# EAGLE design led-er-v2.3d (EAGLE 7.5.0)
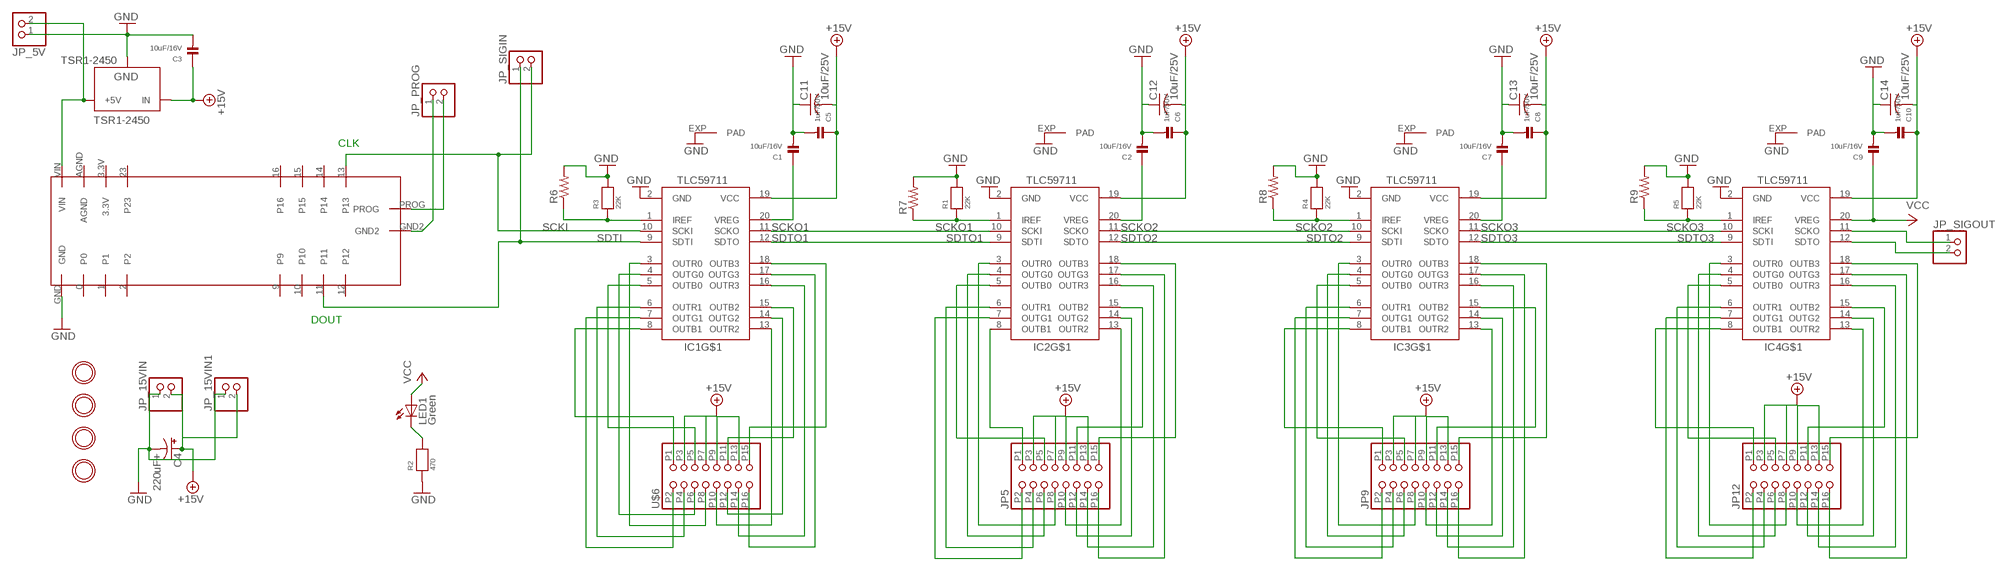
[diagram p0: schematic, sheet 1]

## Parts
C1  10uF/16V  CAP_CERAMIC0805  [0805]
C2  10uF/16V  CAP_CERAMIC0805  [0805]
C3  10uF/16V  CAP_CERAMIC0805  [0805]
C4  220uF+  CPOL-USE5-8.5  [E5-8,5]
C5  1uF/50V  CAP_CERAMIC0805  [0805]
C6  1uF/50V  CAP_CERAMIC0805  [0805]
C7  10uF/16V  CAP_CERAMIC0805  [0805]
C8  1uF/50V  CAP_CERAMIC0805  [0805]
C9  10uF/16V  CAP_CERAMIC0805  [0805]
C10  1uF/50V  CAP_CERAMIC0805  [0805]
C11  10uF/25V  C-USC0805  [C0805]
C12  10uF/25V  C-USC0805  [C0805]
C13  10uF/25V  C-USC0805  [C0805]
C14  10uF/25V  C-USC0805  [C0805]
IC1  TLC59711  [HTSSOP20DAP]
IC2  TLC59711  [HTSSOP20DAP]
IC3  TLC59711  [HTSSOP20DAP]
IC4  TLC59711  [HTSSOP20DAP]
JP5  HEADER-2X8-RIBBON  [2X08_RIBBON]
JP9  HEADER-2X8-RIBBON  [2X08_RIBBON]
JP12  HEADER-2X8-RIBBON  [2X08_RIBBON]
JP_5V  HEADER-1X2  [1X02_OVAL]
JP_15VIN  HEADER-1X2  [1X02_OVAL]
JP_15VIN1  HEADER-1X2  [1X02_OVAL]
JP_PROG  HEADER-1X2  [1X02_OVAL]
JP_SIGIN  HEADER-1X2  [1X02_OVAL]
JP_SIGOUT  HEADER-1X2  [1X02_OVAL]
LED1  Green  LEDCHIP-LED0805  [CHIP-LED0805]
R1  22K  RESISTOR0805  [0805]
R2  470  RESISTOR0805  [0805]
R3  22K  RESISTOR0805  [0805]
R4  22K  RESISTOR0805  [0805]
R5  22K  RESISTOR0805  [0805]
R6  R-US_0207/9  [0207/9]
R7  R-US_0207/10  [0207/10]
R8  R-US_0207/9  [0207/9]
R9  R-US_0207/9  [0207/9]
TSR1-2450  TSR1-2450  [TSR-1]
U$1  MOUNTINGHOLE  [MOUNTINGHOLE_3.0_PLATED]
U$2  MOUNTINGHOLE  [MOUNTINGHOLE_3.0_PLATED]
U$3  MOUNTINGHOLE  [MOUNTINGHOLE_3.0_PLATED]
U$4  MOUNTINGHOLE  [MOUNTINGHOLE_3.0_PLATED]
U$5  TEENSY_LEDER  [TEENSY_LEDER]
U$6  HEADER-2X8-RIBBON  [2X08_RIBBON]

## Nets
+15V: C3.1 C4.+ C5.1 C6.1 C8.1 C10.1 C11.2 C12.2 C13.2 C14.2 IC1.19(VCC) IC2.19(VCC) IC3.19(VCC) IC4.19(VCC) JP5.P3 JP5.P7 JP5.P9 JP5.P13 JP9.P3 JP9.P7 JP9.P9 JP9.P13 JP12.P3 JP12.P7 JP12.P9 JP12.P13 JP_15VIN1.2 JP_15VIN.2 TSR1-2450.1(IN) U$6.P3 U$6.P7 U$6.P9 U$6.P13
GND: C1.2 C2.2 C3.2 C4.- C5.2 C6.2 C7.2 C8.2 C9.2 C10.2 C11.1 C12.1 C13.1 C14.1 IC1.2(GND) IC1.EXP(PAD) IC2.2(GND) IC2.EXP(PAD) IC3.2(GND) IC3.EXP(PAD) IC4.2(GND) IC4.EXP(PAD) JP_5V.1 JP_15VIN1.1 JP_15VIN.1 R1.2 R2.1 R3.2 R4.2 R5.2 R6.2 R7.2 R8.2 R9.2 TSR1-2450.2(GND) U$5.GND
JP1: JP_5V.2 TSR1-2450.3(+5V) U$5.VIN
N$1: LED1.C R2.2
N$2: IC1.1(IREF) R3.1 R6.1
N$3: IC1.4(OUTG0) U$6.P6
N$4: IC1.3(OUTR0) U$6.P8
N$5: IC1.14(OUTG2) U$6.P12
N$6: IC1.13(OUTR2) U$6.P10
N$7: IC2.7(OUTG1) JP5.P2
N$8: IC2.6(OUTR1) JP5.P4
N$9: IC2.5(OUTB0) JP5.P5
N$10: IC2.4(OUTG0) JP5.P6
N$11: IC1.15(OUTB2) U$6.P11
N$12: IC1.16(OUTR3) U$6.P14
N$13: IC1.17(OUTG3) U$6.P16
N$14: IC1.18(OUTB3) U$6.P15
N$15: IC2.1(IREF) R1.1 R7.1
N$16: IC3.8(OUTB1) JP9.P1
N$17: IC2.13(OUTR2) JP5.P10
N$18: IC3.4(OUTG0) JP9.P6
N$19: IC4.7(OUTG1) JP12.P2
N$20: IC3.7(OUTG1) JP9.P2
N$21: IC4.6(OUTR1) JP12.P4
N$22: IC3.6(OUTR1) JP9.P4
N$23: IC2.14(OUTG2) JP5.P12
N$24: IC2.15(OUTB2) JP5.P11
N$25: IC2.16(OUTR3) JP5.P14
N$26: IC2.17(OUTG3) JP5.P16
N$27: IC2.18(OUTB3) JP5.P15
N$28: IC3.1(IREF) R4.1 R8.1
N$29: IC3.14(OUTG2) JP9.P12
N$30: IC2.8(OUTB1) JP5.P1
N$31: IC3.13(OUTR2) JP9.P10
N$37: IC3.15(OUTB2) JP9.P11
N$38: IC3.16(OUTR3) JP9.P14
N$39: IC3.17(OUTG3) JP9.P16
N$40: IC3.18(OUTB3) JP9.P15
N$41: IC4.1(IREF) R5.1 R9.1
N$42: IC2.3(OUTR0) JP5.P8
N$43: IC4.13(OUTR2) JP12.P10
N$44: IC3.5(OUTB0) JP9.P5
N$45: IC1.6(OUTR1) U$6.P4
N$46: IC1.5(OUTB0) U$6.P5
N$47: IC1.7(OUTG1) U$6.P2
N$48: IC1.8(OUTB1) U$6.P1
N$49: IC4.14(OUTG2) JP12.P12
N$50: IC4.15(OUTB2) JP12.P11
N$51: IC4.16(OUTR3) JP12.P14
N$52: IC4.17(OUTG3) JP12.P16
N$53: IC4.18(OUTB3) JP12.P15
N$54: JP_PROG.1 U$5.GND2
N$55: JP_PROG.2 U$5.PROG
N$56: C1.1 IC1.20(VREG)
N$57: C7.1 IC3.20(VREG)
N$58: C2.1 IC2.20(VREG)
N$59: IC4.11(SCKO) JP_SIGOUT.1
N$60: IC4.12(SDTO) JP_SIGOUT.2
N$61: IC3.3(OUTR0) JP9.P8
N$62: IC4.3(OUTR0) JP12.P8
N$71: IC4.4(OUTG0) JP12.P6
N$79: IC4.5(OUTB0) JP12.P5
N$80: IC4.8(OUTB1) JP12.P1
SCKI: IC1.10(SCKI) JP_SIGIN.2 U$5.13
SCKO1: IC1.11(SCKO) IC2.10(SCKI)
SCKO2: IC2.11(SCKO) IC3.10(SCKI)
SCKO3: IC3.11(SCKO) IC4.10(SCKI)
SDTI: IC1.9(SDTI) JP_SIGIN.1 U$5.11
SDTO1: IC1.12(SDTO) IC2.9(SDTI)
SDTO2: IC2.12(SDTO) IC3.9(SDTI)
SDTO3: IC3.12(SDTO) IC4.9(SDTI)
VCC: C9.1 IC4.20(VREG) LED1.A
Unconnected: U$5.0 U$5.1 U$5.2 U$5.3.3V U$5.9 U$5.10 U$5.12 U$5.14 U$5.15 U$5.16 U$5.23 U$5.AGND

## Notes on the sheet
- CLK
- DOUT

## Library data of the parts
C1-C3 C5-C10 = microbuilder:CAP_CERAMIC: Ceramic Capacitors 0402 - 0402 Surface Mount Capacitors 16pF 50V 5% [Digikey: 445-4899-2-ND] 18pF 50V 5% [Digikey: 490-1281-2-ND] 22pF 50V 5% [Digikey: 490-1283-2-ND] 68pF 50V 5% [Digikey: 490-1289-2-ND] 0.1uF 10V 10% [Digikey: 490-1318-2-ND] 1.0uF 6.3V 10% [Digikey: 490-1320-2-ND] 0603 - 0603 Surface Mount Capacitors 16 pF 50V 5% [Digikey: 445-5051-2-ND] 22 pF 50V [Digikey: PCC220ACVTR-ND] 33 pF 50V 5% [Digikey: 490-1415-1-ND] 56pF 50V 5% [Digikey: 490-1421-1-ND] 220pF 50V 5% [Digikey: 445-1285-1-ND] 680 pF 50V 2200 pF 50V 5% C0G [Digikey: 445-1297-1-ND] 5600 pF 100V 5% X7R [Digikey: 478-3711-1-ND] 0.1 µF 25V 10% [Digikey: PCC2277TR-ND] 0.22 µF 16V 10% X7R [Digikey: 445-1318-1-ND] 1.0 µF 25V 10% [Digikey: 445-5146-2-ND] 0603 - RF Specific 3pF 250V +/-0.1pF RF [Digikey: 712-1347-1-ND] 18 pF 250V 5% [Digikey: 478-3505-1-ND or 712-1322-1-ND] 56 pF 250V 5% C0G RF [Digikey: 490-4867-1-ND] 68 pF 250V RF [Digikey: 490-4868-1-ND] 0805 - 0805 Surface Mount Capacitors 220 pF 250V 2% RF Ceramic Capacitor [Digikey: 712-1398-1-ND] 1000 pF 50V 2% NP0 Ceramic Capacitor [Digikey: 478-3760-1-ND] 0.1 µF 25V 10% Ceramic Capacitor [Digikey: PCC1828TR-ND] 1.0 µF 16V 10% Ceramic Capacitor[Digikey: 490-1691-2-ND] 10.0 µF 10V 10% Ceramic Capacitor[Digikey: 709-1228-1-ND] 10.0 uF 16V 10% Ceramic Capacitor [Digikey: 478-5165-2-ND] 47 uF 6.3V 20% Ceramic Capacitor [Digikey: 587-1779-1-ND or 399-5506-1-ND] 1206 - 1206 Surface Mount Capacitors 47uF 10V 20% Ceramic Capacitor [Digikey: 490-5528-1-ND or 399-5508-1-ND or 445-6010-1-ND] 100uF 6.3V -20%, +80% Y5V Ceramic Capacitor (Digikey: 490-4512-1-ND, Mouser: 81-GRM31CF50J107ZE1L)
C4 = adafruit:CPOL-US: POLARIZED CAPACITOR, American symbol
C11-C14 = adafruit:C-US: CAPACITOR, American symbol
IC1-IC4 = adafruit:TLC59711
JP5 JP9 JP12 U$6 = Andrews:HEADER-2X8-RIBBON
JP_5V JP_15VIN JP_15VIN1 JP_PROG JP_SIGIN JP_SIGOUT = microbuilder:HEADER-1X2: PIN HEADER
LED1 = adafruit:LED: LED OSRAM: - CHIPLED LG R971, LG N971, LY N971, LG Q971, LY Q971, LO R971, LY R971 LH N974, LH R974 LS Q976, LO Q976, LY Q976 LO Q996 - Hyper CHIPLED LW Q18S LB Q993, LB Q99A, LB R99A - SideLED LS A670, LO A670, LY A670, LG A670, LP A670 LB A673, LV A673, LT A673, LW A673 LH A674 LY A675 LS A676, LA A676, LO A676, LY A676, LW A676 LS A679, LY A679, LG A679 - Hyper Micro SIDELED® LS Y876, LA Y876, LO Y876, LY Y876 LT Y87S - SmartLED LW L88C, LW L88S LB L89C, LB L89S, LG L890 LS L89K, LO L89K, LY L89K LS L896, LA L896, LO L896, LY L896 - TOPLED LS T670, LO T670, LY T670, LG T670, LP T670 LSG T670, LSP T670, LSY T670, LOP T670, LYG T670 LG T671, LOG T671, LSG T671 LB T673, LV T673, LT T673, LW T673 LH T674 LS T676, LA T676, LO T676, LY T676, LB T676, LH T676, LSB T676, LW T676 LB T67C, LV T67C, LT T67C, LS T67K, LO T67K, LY T67K, LW E67C LS E67B, LA E67B, LO E67B, LY E67B, LB E67C, LV E67C, LT E67C LW T67C LS T679, LY T679, LG T679 LS T770, LO T770, LY T770, LG T770, LP T770 LB T773, LV T773, LT T773, LW T773 LH T774 LS E675, LA E675, LY E675, LS T675 LS T776, LA T776, LO T776, LY T776, LB T776 LHGB T686 LT T68C, LB T68C - Hyper Mini TOPLED® LB M676 - Mini TOPLED Santana® LG M470 LS M47K, LO M47K, LY M47K Source: http://www.osram.convergy.de/
R1-R5 = microbuilder:RESISTOR: Resistors 0402 - 0402 Surface Mount Package 22 Ohm 1% 1/16W [Digikey: 311-22.0LRTR-ND] 33 Ohm 5% 1/16W 1.0K 5% 1/16W 1.5K 5% 1/16W 2.0K 1% 1/16W 10.0K 1% 1/16W [Digikey: 311-10.0KLRTR-ND] 10.0K 5% 1/16W [Digikey: RMCF0402JT10K0TR-ND] 12.1K 1% 1/16W [Digikey: 311-22.0LRTR-ND] 100.0K 5% 1/16W 0603 - 0603 Surface Mount Package 0 Ohm 1/10 Watt 1% Resistor 15 Ohm 1/10 Watt 1% Resistor 33 Ohm 1/10 Watt 1% Resistor 49.9 Ohm 1/10 Watt 1% Resistor 100 Ohm 1/10 Watt 1% Resistor 150 Ohm 1/10 Watt 1% Resistor 240 Ohm 1/10 Watt 1% Resistor 390 Ohm 1/10 Watt 1% Resistor 560 Ohm 1/10 Watt 1% Resistor 680 Ohm 1/10 Watt 1% Resistor 750 Ohm 1/10 Watt 1% Resistor 1.0K Ohm 1/10 Watt 1% Resistor 1.5K Ohm 1/10 Watt 1% Resistor 2.0K Ohm 1/10 Watt 1% Resistor 2.2K Ohm 1/10 Watt 1% Resistor 3.3K Ohm 1/10 Watt 1% Resistor 4.7K Ohm 1/10 Watt 1% Resistor 10.0K Ohm 1/10 Watt 1% Resistor 12.0K Ohm 1/10 Watt 1% Resistor 12.1K Ohm 1/10 Watt 1% Resistor 20.0K Ohm 1/10 Watt 1% Resistor 33.0K Ohm 1/10 Watt 1% Resistor 100.0K Ohm 1/10 Watt 1% Resistor 0805 - 0805 Surface Mount Package 0 Ohm 1/8 Watt 1% Resistor 33 Ohm 1/8 Watt 1% Resistor 100 Ohm 1/8 Watt 1% Resistor 150 Ohm 1/8 Watt 1% Resistor 200 Ohm 1/8 Watt 1% Resistor 240 Ohm 1/8 Watt 1% Resistor 330 Ohm 1/8 Watt 1% Resistor 390 Ohm 1/8 Watt 1% Resistor 470 Ohm 1/8 Watt 1% Resistor 1.0K Ohm 1/8 Watt 1% Resistor 1.5K Ohm 1/8 Watt 1% Resistor 2.0K Ohm 1/8 Watt 1% Resistor 4.7K Ohm 1/8 Watt 1% Resistor 5.1K Ohm 1/8 Watt 1% Resistor 5.6K Ohm 1/8 Watt 1% Resistor 10.0K Ohm 1/8 Watt 1% Resistor 22.0K Ohm 1/8 Watt 1% Resistor 33.0K Ohm 1/8 Watt 1% Resistor 100K Ohm 1/8 Watt 1% Resistor 1206 - 1206 Surface Mount Package 2012 - 2010 Surface Mount Package 0.11 Ohm 1/2 Watt 1% Resistor - Digikey: RHM.11UCT-ND
R6-R9 = adafruit:R-US_: RESISTOR, American symbol
TSR1-2450 = SteelCaveRobotics-Power:TSR1-2450: Traco Power TSR 1-2450 5.0v switching regulator
U$1-U$4 = microbuilder:MOUNTINGHOLE: Mounting Hole For #2 screws (0.086"/2.18mm width, 0.094"/2.4mm hole) use 2.5mm
U$5 = Andrews:TEENSY_LEDER

## Board
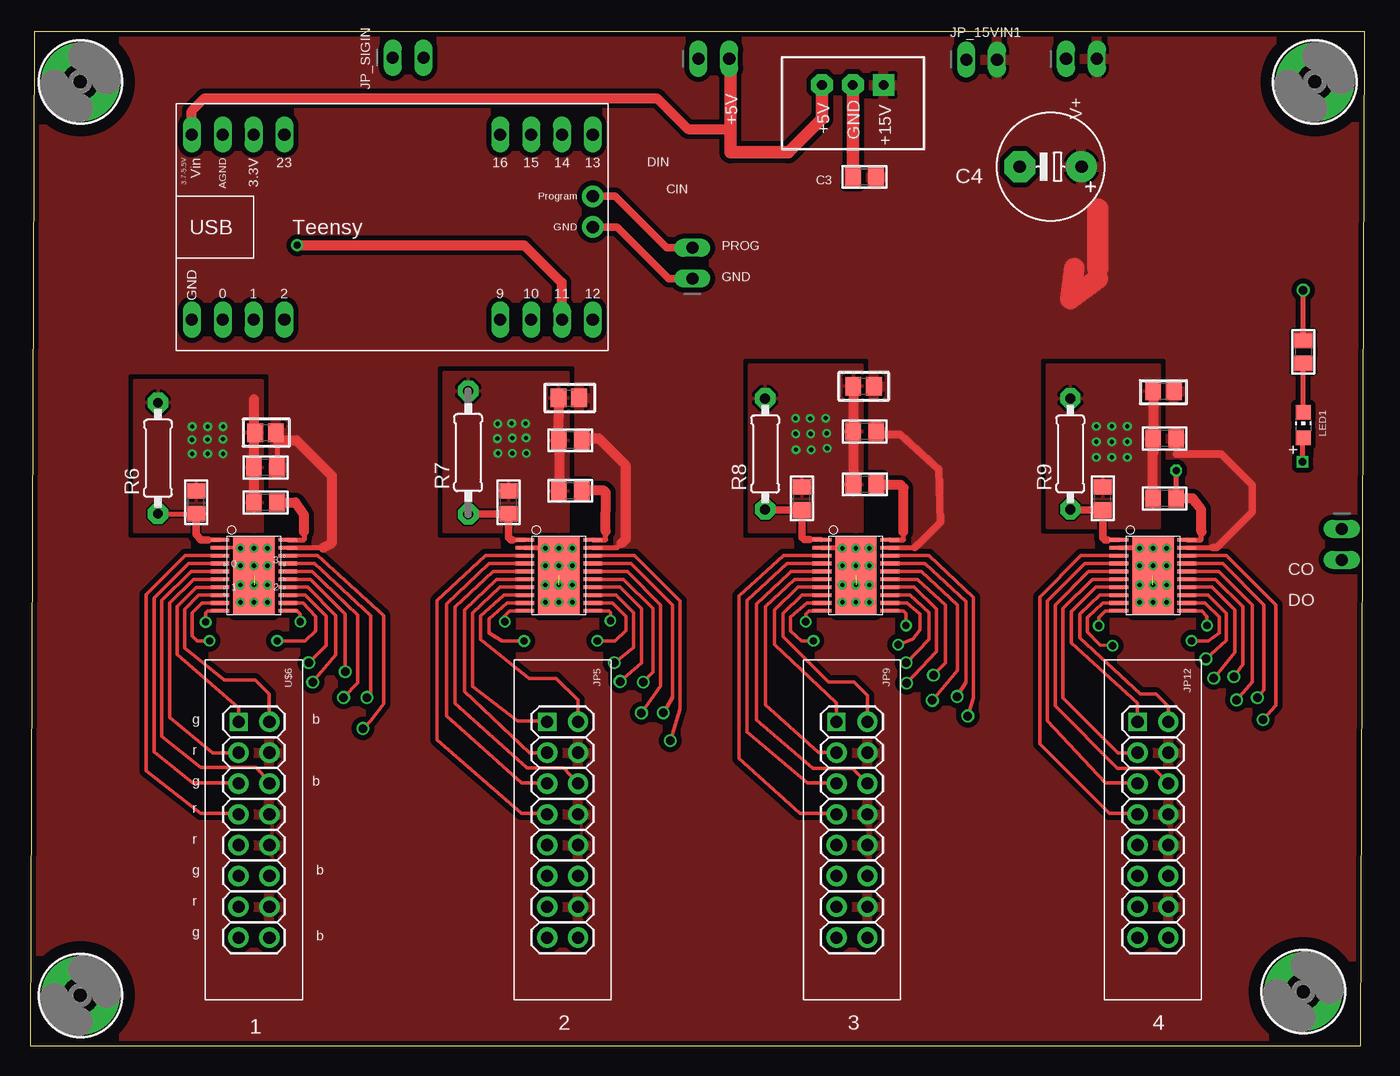
[diagram p1: board, top side]
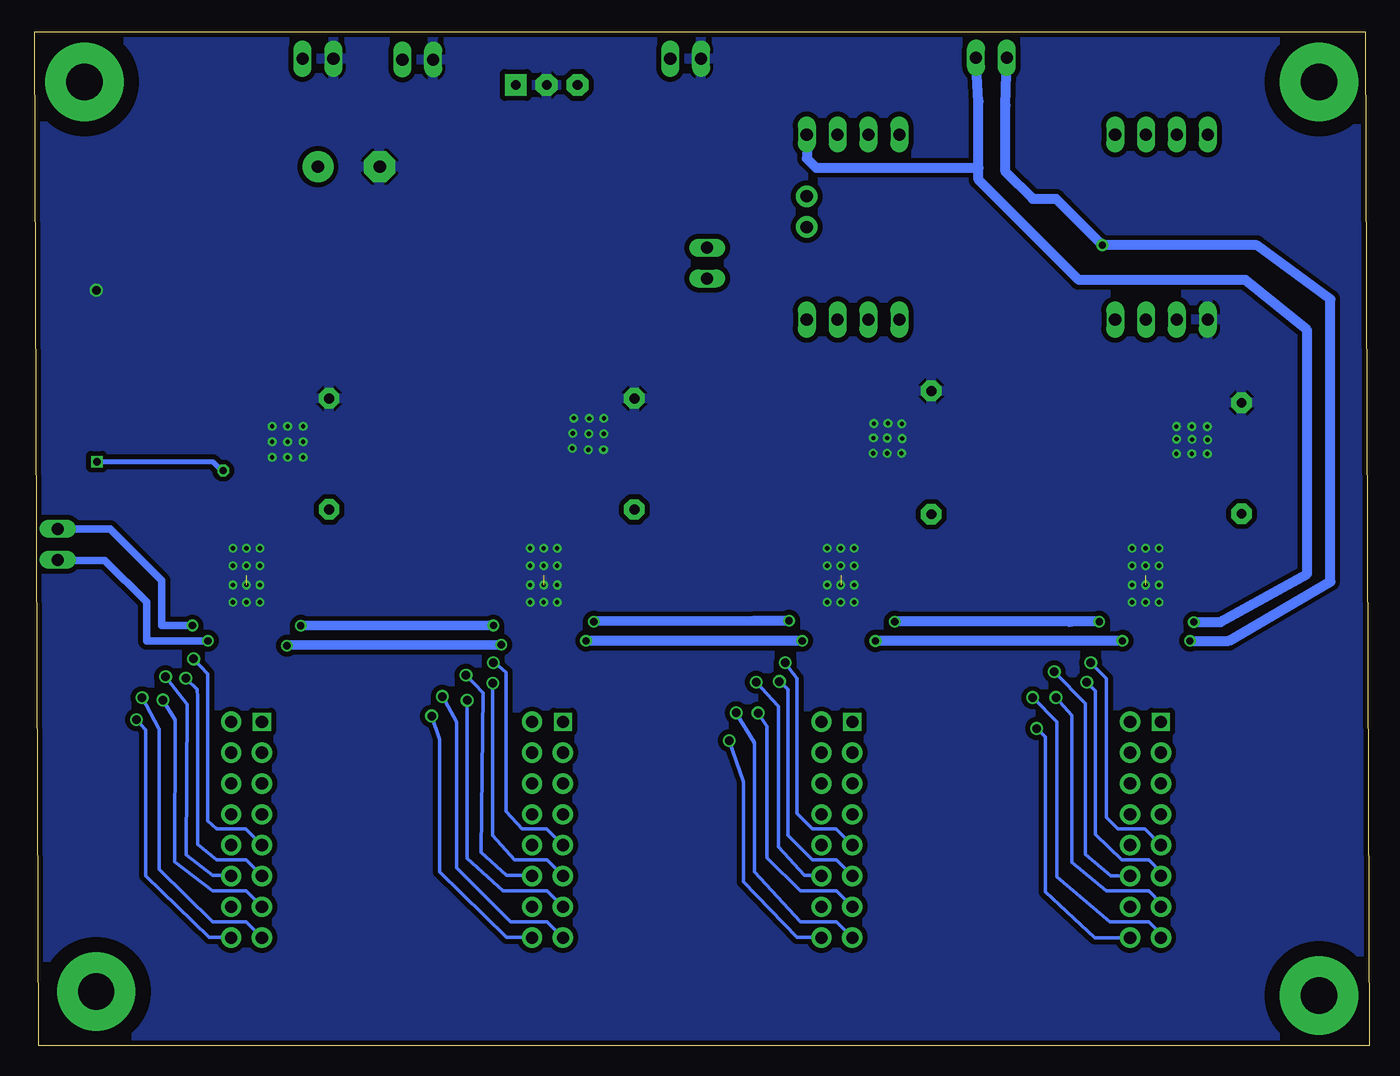
[diagram p2: board, bottom side, seen from below]

Size 109.91 x 83.49 mm. Coordinates in mm from the lower left corner, seen from the top.
Outline: 0,0 109.59,0 109.91,83.49 0.32,83.49 0,0
Copper layers (1*16): Top 0.0356mm / dielectric 1.5011mm / Bottom 0.0356mm
Design rules "LaenPCBOrder": minimum track width 6mil, minimum drill 13mil, track to track 6mil, track to pad 6mil, pad to pad 6mil, via to via 6mil, smd to smd 6mil, copper to edge 15mil, drill to drill 6mil, minimum pad ring 7mil, minimum via ring 7mil, stop-mask expansion 3mil, vias tented up to drill 0mil, thermal gap 10mil
tRestrict: area 17.5,17.5 to 19.4,18.1; area 18.5,15 to 19.4,15.3; area 42.6,17.6 to 44.9,17.9; area 66.6,17.5 to 68.5,17.8; area 67.2,15 to 68.5,15.3; area 92.1,17.5 to 93.3,17.8

### Footprints (pad centres in the part's own frame; a part is rotated, then mirrored left to right if it is on the bottom)
0805 = smd 1.3 x 1.5: 1 -0.95,0; 2 0.95,0
E5-8,5 = drill 1.016 pad 2.54: + -2.54,0 | drill 1.016 pad 2.54 octagon: - 2.54,0
C0805 = smd 1.3 x 1.5: 1 -0.85,0; 2 0.85,0
HTSSOP20DAP = smd 0.3 x 1.55: 1 -2.925,-2.8; 2 -2.275,-2.8; 3 -1.625,-2.8; 4 -0.975,-2.8; 5 -0.325,-2.8; 6 0.325,-2.8; 7 0.975,-2.8; 8 1.625,-2.8; 9 2.275,-2.8; 10 2.925,-2.8; 11 2.925,2.8; 12 2.275,2.8; 13 1.625,2.8; 14 0.975,2.8; 15 0.325,2.8; 16 -0.325,2.8; 17 -0.975,2.8; 18 -1.625,2.8; 19 -2.275,2.8; 20 -2.925,2.8 | smd 6.5 x 3.4: EXP 0,0
2X08_RIBBON = drill 1 pad 1.676: P1 -8.89,1.27; P3 -6.35,1.27; P4 -6.35,-1.27; P5 -3.81,1.27; P6 -3.81,-1.27; P7 -1.27,1.27; P8 -1.27,-1.27; P9 1.27,1.27; P10 1.27,-1.27; P11 3.81,1.27; P12 3.81,-1.27; P13 6.35,1.27; P14 6.35,-1.27; P15 8.89,1.27; P16 8.89,-1.27 | drill 1 square: P2 -8.89,-1.27
1X02_OVAL = drill 1 long: 1 -1.27,0; 2 1.27,0
CHIP-LED0805 = smd 1.2 x 1.2: A 0,-1.05; C 0,1.05
0207/9 = drill 0.813 pad 1.676 octagon: 1 -4.572,0; 2 4.572,0
0207/10 = drill 0.813 pad 1.676 octagon: 1 -5.08,0; 2 5.08,0
TSR-1 = drill 0.8 pad 1.8 square: 1 -2.54,-1.5 | drill 0.8 pad 1.8 octagon: 2 0,-1.5; 3 2.54,-1.5
MOUNTINGHOLE_3.0_PLATED = drill 3 pad 6.452: P$1 0,0
TEENSY_LEDER = drill 1 pad 1.422 long: 0 12.7,7.62; 1 10.16,7.62; 2 7.62,7.62; 3.3V 10.16,-7.62; 9 -10.16,7.62; 10 -12.7,7.62; 11 -15.24,7.62; 12 -17.78,7.62; 13 -17.78,-7.62; 14 -15.24,-7.62; 15 -12.7,-7.62; 16 -10.16,-7.62; 23 7.62,-7.62; AGND 12.7,-7.62; GND 15.24,7.62; VIN 15.24,-7.62 | drill 1 pad 1.778: GND2 -17.78,0; PROG -17.78,-2.54

### Placement (x,y rotation side)
C1  19.37,44.74 180 top
C2  44.48,45.7 180 top
C3  68.69,71.55 180 top
C4  84.04,72.4 180 top
C5  19.37,47.63 180 top
C6  44.48,49.86 180 top
C7  68.74,46.23 180 top
C8  68.72,50.58 180 top
C9  93.42,45.06 180 top
C10  93.42,50.01 180 top
C11  19.37,50.48 0 top
C12  44.35,53.35 0 top
C13  68.63,54.31 0 top
C14  93.32,53.91 0 top
IC1  18.42,38.73 270 top
IC2  43.52,38.73 270 top
IC3  67.99,38.73 270 top
IC4  92.46,38.73 270 top
JP5  43.84,17.78 270 top
JP9  67.68,17.78 270 top
JP12  92.46,17.78 270 top
JP_5V  56.29,81.28 0 top
JP_15VIN  86.58,81.28 0 top
JP_15VIN1  78.35,81.22 0 top
JP_PROG  54.53,64.45 90 top
JP_SIGIN  31.11,81.38 0 top
JP_SIGOUT  108.02,41.28 270 top
LED1  104.84,51.12 0 top
R1  39.4,44.75 90 top
R2  104.84,57.15 270 top
R3  13.66,44.75 90 top
R4  63.55,45.07 90 top
R5  88.34,45.07 90 top
R6  10.51,48.38 90 top
R7  36.06,48.85 90 top
R8  60.52,48.73 90 top
R9  85.66,48.74 90 top
TSR1-2450  67.74,77.63 180 top
U$1  105.8,79.38 0 top
U$2  4.12,4.12 0 top
U$3  104.84,4.44 0 top
U$4  4.12,79.38 0 top
U$5  28.54,67.42 180 top
U$6  18.42,17.78 270 top

### Tracks (layer width: path | path; a pad name or v marks a point on that pad's centre or on a via)
+15V
  Top 0.406: IC1.19 24.13,41.01 | 20.32,49.86 C5.1 | IC2.19 48.33,41.01 48.73,41.41 | 45.58,50.01 C6.1 | IC3.19 72.86,41.01 | 69.74,50.33 C8.1 | IC4.19 97.39,41.01 | 94.37,48.73 C10.1
  Top 0.61: 69.74,50.33 71.67,50.33 74.85,47.46 74.94,43.07 73.42,41.55 72.86,41.01 | 94.37,48.73 98.1,48.73 100.65,46.19 100.65,43.95 97.7,41.01 97.39,41.01
  Top 0.813: 20.32,49.86 21.91,49.86 24.84,46.93 24.84,41.41 24.13,41.01 | 45.58,50.01 46.82,50.01 49.05,47.78 49.05,41.73 48.73,41.41
  Top 1.676: 87.91,63.16 85.68,61.47 86,64.02
  Top 1.778: 87.91,68.89 87.91,64.02
  pour Top (isolate 0.406, rank 2): 0.32,83.19 0,0 109.29,0 109.6,83.19
GND  (via drill 0.36, 0.7)  (4 unrouted)
  Top 0.305: 42.2,41.01 v42.41,40.96 | IC1.2 17.47,41.01 v17.31,40.96
  Top 0.406: IC2.2 42.2,41.01 | R2.1 v104.84,62.23 | IC3.2 67.04,41.01 v66.88,40.96 | IC4.2 91.51,41.01 v91.35,40.96 | 43.53,40.8 v43.52,40.96
  Top 0.61: 18.42,45.37 C1.2 | 18.42,53.25 C11.1 | 43.47,49.96 C6.2
  Top 0.813: C1.2 C5.2 18.42,53.25 | C12.1 43.47,49.96 | C6.2 C2.2 | C13.1 67.78,50.27 C8.2 67.77,46.24 C7.2 | 67.79,41 v67.99,40.96 | C9.2 C10.2 92.47,48.75 C14.1
  Top 1.016: TSR1-2450.2 C3.2
  other vias: 93.57,36.51 92.46,36.51 91.35,36.51 93.57,37.94 92.46,37.94 91.35,37.94 93.57,39.53 92.46,39.53 91.35,39.53 69.1,37.94 67.99,37.94 66.88,37.94 69.1,36.51 67.99,36.51 66.88,36.51 69.1,39.53 67.99,39.53 66.88,39.53 42.41,37.94 43.52,37.94 44.64,37.94 44.64,39.53 43.52,39.53 42.41,39.53 42.41,36.51 43.52,36.51 44.64,36.51 19.53,39.53 18.42,39.53 17.31,39.53 18.42,40.96 19.53,40.96 19.53,37.94 18.42,37.94 17.31,37.94 17.31,36.51 18.42,36.51 19.53,36.51 44.64,40.96 69.1,40.96 92.46,40.96 93.57,40.96 15.87,50.99 14.59,49.93 15.87,48.76 13.3,49.91 13.33,48.76 38.49,51.21 40.83,50.05 39.63,51.26 40.78,51.24 39.7,50.05 38.47,50 65.64,49.19 64.32,49.09 65.52,51.68 64.27,50.4 63.03,50.4 15.87,49.96 14.6,48.76 13.33,50.99 14.6,50.99 39.7,48.8 38.52,48.79 40.84,48.79 63.06,49.09 65.58,50.44 64.23,51.66 63.02,51.66 87.8,49.74 89.08,48.47 87.8,48.47 90.35,49.74 90.35,51.02 89.08,51.02 89.08,49.74 90.35,48.47 87.8,51.02
  pour Bottom (isolate 0.406, rank 2): 0,83.19 0,0 109.6,0 109.6,83.19
  pour Top: 8.6,54.78 19.11,54.78 19.11,42.36 8.6,42.36
  pour Top: 34.08,42.36 34.08,55.42 44.27,55.42 44.27,42.36
  pour Top: 59.24,42.36 68.48,42.36 68.48,56.06 59.24,56.06
  pour Top: 83.77,56.06 93.01,56.06 93.01,42.68 83.77,42.68
JP1
  Top 0.813: U$5.VIN 13.3,77 14.33,78.04 51.6,78.04 54.15,75.49 57.65,75.49
  Top 1.016: JP_5V.2 57.65,80.87 57.65,75.49 57.65,73.58 62.43,73.58 65.2,76.35 TSR1-2450.3
N$1
  Top 0.406: LED1.C R2.2
N$2
  Top 0.406: R6.1 14.29,43.8 R3.1 | IC1.1 14.63,41.66 | 14.63,41.66
  Top 0.61: 14.63,41.66 14.08,41.66 13.65,42.09 R3.1
N$3
  Top 0.305: IC1.4 13.03,39.71 10.19,36.88 10.19,24.21 13.38,21.66 17.08,21.66 U$6.P6
N$4
  Top 0.305: IC1.3 12.76,40.36 9.55,37.16 9.55,22.61 14.02,19.11 17.09,19.11 U$6.P8
N$5  (via drill 0.7)
  Top 0.305: IC1.14 22.82,37.76 25.16,35.42 25.16,32.17 v23.25,29.94
  Bottom 0.305: U$6.P12 17.15,14.28 18.16,15.29 20.39,15.29 22.54,17.41 22.54,29.2 v23.25,29.94
N$6  (via drill 0.7)
  Top 0.305: IC1.13 22.65,37.11 23.25,36.51 24.37,35.39 24.37,32.96 v22.93,31.53
  Bottom 0.305: v22.93,31.53 21.66,30.26 21.66,18.79 20.7,17.84 18.48,17.84 U$6.P10
N$7
  Top 0.305: IC2.7 38.69,37.76 36.43,35.64 36.43,29.57 40.13,26.75 42.48,26.75 JP5.P2
N$8
  Top 0.305: IC2.6 38.41,38.41 35.76,35.88 35.76,29.16 41.13,24.12 JP5.P4
N$9
  Top 0.305: IC2.5 38.1,39.06 34.98,36.14 34.98,28.18 40.93,22.87 43.93,22.87 JP5.P5
N$10
  Top 0.305: IC2.4 37.8,39.71 34.27,36.4 34.27,27.16 40.45,21.66 42.5,21.66 JP5.P6
N$11  (via drill 0.7)
  Top 0.305: IC1.15 23.07,38.41 25.94,35.57 v25.94,30.79
  Bottom 0.305: U$6.P11 21.29,13.97 23.37,15.74 23.37,28.16 v25.94,30.79
N$12  (via drill 0.7)
  Top 0.305: IC1.16 23.22,39.05 26.97,35.46 26.97,29.88 v25.8,28.67
  Bottom 0.305: U$6.P14 17.15,11.73 18.16,12.74 21.66,12.74 24.48,15.11 24.48,27.21 v25.8,28.67
N$13  (via drill 0.7)
  Top 0.305: IC1.17 23.41,39.71 28.03,35.41 28.03,28.98 v27.71,28.67
  Bottom 0.305: U$6.P16 17.15,9.19 18.16,10.19 21.34,10.19 25.73,13.91 25.73,26.65 v27.71,28.67
N$14  (via drill 0.7)
  Top 0.305: IC1.18 23.65,40.35 29.08,35.44 29.08,28.13 28.03,26.75 | 28.03,26.75 | 28.03,26.75 v27.39,26.12
  Bottom 0.305: U$6.P15 22.58,8.89 26.67,12.67 26.67,25.41 v27.39,26.12
N$15
  Top 0.406: IC2.1 39.7,41.66 | 39.7,41.66
  Top 0.61: R7.1 36.14,43.8 R1.1 39.4,41.85 39.59,41.66 39.7,41.66
N$16
  Top 0.305: IC3.8 63.56,37.11 61.97,35.61 61.97,33.72 65.73,29.95 67.84,29.94 68.94,28.84 JP9.P1
N$17  (via drill 0.7)
  Top 0.305: IC2.13 48.25,37.11 49.69,35.67 49.69,32.81 v48.1,31.53
  Bottom 0.305: v48.1,31.53 47.14,30.26 47.14,19.11 45.87,17.84 43.9,17.84 JP5.P10
N$18
  Top 0.305: IC3.4 62.32,39.71 59.02,36.67 59.02,25.84 64.02,21.66 66.33,21.66 JP9.P6
N$19
  Top 0.305: IC4.7 87.77,37.76 85.75,35.77 85.75,33.18 91.18,28.22 91.18,26.68 JP12.P2
N$20
  Top 0.305: IC3.7 63.24,37.76 61.29,35.88 61.29,33.05 66.4,28.24 JP9.P2
N$21
  Top 0.305: IC4.6 87.46,38.41 85.04,35.99 85.04,28.62 89.56,24.11 91.17,24.11 JP12.P4
N$22
  Top 0.305: IC3.6 62.93,38.41 60.56,36.16 60.56,28.07 64.92,24.13 JP9.P4
N$23  (via drill 0.7)
  Top 0.305: IC2.14 48.56,37.76 50.33,35.99 50.33,31.53 v48.58,29.99
  Bottom 0.305: v48.58,29.99 47.86,29.32 47.88,17.32 45.87,15.29 43.89,15.29 JP5.P12
N$24  (via drill 0.7)
  Top 0.305: IC2.15 48.87,38.41 51.28,35.99 51.28,30.78 v50.49,29.94
  Bottom 0.305: v50.49,29.94 48.67,27.95 48.67,16.37 46.5,14.02 45.16,14.02 JP5.P11
N$25  (via drill 0.7)
  Top 0.305: IC2.16 49.17,39.06 51.92,36.31 51.92,29.62 v50.33,27.39
  Bottom 0.305: v50.33,27.39 49.6,26.29 49.6,15.46 46.82,12.74 43.88,12.74 JP5.P14
N$26  (via drill 0.7)
  Top 0.305: IC2.17 49.48,39.71 52.87,36.31 52.87,28.67 v52.13,27.41
  Bottom 0.305: JP5.P16 43.88,10.19 46.82,10.19 50.62,14.3 50.62,24.94 v52.13,27.41
N$27  (via drill 0.7)
  Top 0.305: IC2.18 49.78,40.36 53.51,36.63 53.51,27.71 v52.71,25.12
  Bottom 0.305: JP5.P15 45.14,8.92 47.14,8.92 51.53,13.51 51.53,21.71 v52.71,25.12
N$28
  Top 0.305: IC3.1 65.17,41.68
  Top 0.406: 65.17,41.68 64.16,41.68 64.16,41.67
  Top 0.61: R8.1 60.56,44.12 R4.1 63.55,41.87 63.75,41.67 64.16,41.67
N$29  (via drill 0.7)
  Top 0.305: IC3.14 72.77,37.76 74.65,35.96 74.65,32.46 v72.18,29.86
  Bottom 0.305: v72.18,29.86 72.2,17.3 70.39,15.29 67.73,15.29 JP9.P12
N$30
  Top 0.305: IC2.8 39.01,37.1 37.1,35.38 37.1,33.47 41.09,30.26 43.32,30.26 45.11,28.47 JP5.P1
N$31  (via drill 0.7)
  Top 0.305: IC3.13 72.46,37.11 74.01,35.67 74.01,33.44 v72.14,31.53
  Bottom 0.305: v72.14,31.53 71.98,31.53 71.09,30.74 71.09,19.27 69.75,17.84 67.73,17.84 JP9.P10
N$37  (via drill 0.7)
  Top 0.305: IC3.15 73.07,38.41 75.37,36.28 75.37,31.5 v74.39,30.52
  Bottom 0.305: v74.39,30.52 72.99,29.06 73.12,15.9 71.03,14.02 68.99,14.02 JP9.P11
N$38  (via drill 0.7)
  Top 0.305: IC3.16 73.38,39.06 76.34,36.31 76.34,30.9 v74.29,28.44
  Bottom 0.305: v74.29,28.44 74.3,15.43 71.35,12.74 67.72,12.74 JP9.P14
N$39  (via drill 0.7)
  Top 0.305: IC3.17 73.68,39.71 77.04,36.6 77.04,29.91 v76.33,28.76
  Bottom 0.305: v76.33,28.76 75.18,26.64 75.18,14.65 70.71,10.19 67.71,10.19 JP9.P16
N$40  (via drill 0.7)
  Top 0.305: IC3.18 73.99,40.36 77.69,36.91 77.69,28.63 v77.21,27.15
  Bottom 0.305: JP9.P15 68.98,8.92 71.03,8.92 76.58,14.32 76.58,25.23 v77.21,27.15
N$41
  Top 0.406: IC4.1 88.7,41.66
  Top 0.61: R9.1 85.7,44.12 R5.1 88.34,41.82 88.5,41.66 88.7,41.66
N$42
  Top 0.305: IC2.3 37.49,40.36 33.52,36.65 33.52,25.18 40.45,19.11 42.51,19.11 JP5.P8
N$43  (via drill 0.7)
  Top 0.305: IC4.13 96.99,37.11 98.52,35.6 98.52,33.37 v96.83,31.85
  Bottom 0.305: v96.83,31.85 95.68,30.6 95.68,18.5 94.92,17.84 92.52,17.84 JP12.P10
N$44
  Top 0.305: IC3.5 62.63,39.06 62.43,38.86 | 62.43,38.86 | 62.43,38.86 59.82,36.38 59.82,26.84 64.45,22.84 65.71,22.84 65.72,22.85 67.7,22.85 JP9.P5
N$45
  Top 0.305: IC1.6 13.44,38.41 11.47,36.44 11.47,27.03 15.01,24.12 U$6.P4 16.79,24.13
N$46
  Top 0.305: IC1.5 13.23,39.05 10.83,36.66 10.83,25.48 14.04,22.91 18.56,22.91 19.69,21.78 U$6.P5
N$47
  Top 0.305: IC1.7 13.66,37.75 12.09,36.19 12.09,32.23 17.15,27.81 U$6.P2
N$48
  Top 0.305: IC1.8 13.86,37.11 12.69,35.94 12.69,32.76 15.97,30.12 18.52,30.12 19.69,28.95 U$6.P1
N$49  (via drill 0.7)
  Top 0.305: IC4.14 97.29,37.76 99.22,35.9 99.22,32.39 v97.47,30.26
  Bottom 0.305: JP12.P12 92.51,15.29 94.92,15.29 96.49,16.59 96.49,28.69 96.53,29.33 v97.47,30.26
N$50  (via drill 0.7)
  Top 0.305: IC4.15 97.6,38.41 99.87,36.16 99.87,31.38 v99.13,30.38
  Bottom 0.305: JP12.P11 93.78,14.02 95.24,14.02 97.42,15.71 97.37,28.1 v99.13,30.38
N$51  (via drill 0.7)
  Top 0.305: IC4.16 97.9,39.06 100.65,36.31 100.65,29.94 v99.35,28.47
  Bottom 0.305: JP12.P14 92.5,12.74 95.24,12.74 98.38,15.14 98.35,26.51 98.35,26.83 v99.35,28.47
N$52  (via drill 0.7)
  Top 0.305: IC4.17 98.21,39.71 101.61,36.31 101.61,29.3 v101.07,28.66
  Bottom 0.305: JP12.P16 92.5,10.19 95.24,10.19 99.65,14.53 99.67,26.07 99.7,26.14 v101.07,28.66
N$53  (via drill 0.7)
  Top 0.305: IC4.18 98.52,40.36 102.56,36.31 102.56,28.03 v101.54,26.85
  Bottom 0.305: v101.54,26.85 100.78,25.99 100.75,14 95.56,8.92 93.76,8.92 JP12.P15
N$54
  Top 0.406: JP_PROG.1
  Top 0.61: U$5.GND2 48.33,67.42 52.57,63.19 JP_PROG.1
N$55
  Top 0.406: 54.51,65.74 JP_PROG.2
  Top 0.61: U$5.PROG 48.17,69.96 52.39,65.74 54.51,65.74
N$56
  Top 0.406: 22.55,42.34 22.55,41.66 IC1.20
  Top 0.813: C1.1 21.83,44.74 22.54,43.71 22.55,42.34
N$57
  Top 0.406: 71.48,41.66 IC3.20 71.92,41.66 71.91,42.34
  Top 0.813: 71.91,42.34 71.92,45.94 71.67,46.19 69.73,46.19 C7.1
N$58
  Top 0.406: IC2.20 47.39,41.66 47.39,42.06 47.39,42.38 | C2.1
  Top 0.813: C2.1 47.23,45.71 47.4,45.54 47.39,42.38
N$59  (via drill 0.6)
  Top 0.305: IC4.11 | IC4.11 96.47,35.81 96.91,35.37 v96.91,34.6
  Bottom 0.406: JP_SIGOUT.1
  Bottom 0.61: v96.91,34.6 99.43,34.6 99.43,38.31 103.67,42.55 JP_SIGOUT.1
N$60  (via drill 0.6)
  Top 0.305: IC4.12 96.75,36.45 97.93,35.3 97.94,34.01 97.04,33.34 v95.64,33.34
  Bottom 0.406: 107.97,39.96 JP_SIGOUT.2
  Bottom 0.61: v95.64,33.34 100.7,33.34 100.7,36.53 104.14,39.96 107.97,39.96
N$61
  Top 0.305: IC3.3 62.02,40.36 58.35,37.04 58.35,23.66 63.38,19.11 66.34,19.11 JP9.P8
N$62
  Top 0.305: IC4.3 86.54,40.36 83.13,36.95 83.13,24.84 88.87,19.11 91.13,19.11 JP12.P8
N$71
  Top 0.305: IC4.4 86.85,39.71 83.77,36.63 83.77,26.75 88.55,21.66 91.12,21.66 JP12.P6
N$79
  Top 0.305: IC4.5 87.15,39.06 84.41,36.31 84.41,27.96 89.52,22.85 90.61,22.85 | 90.61,22.85 92.54,22.85 JP12.P5 | 90.61,22.85
N$80
  Top 0.305: IC4.8 88.07,37.11 86.44,35.55 86.46,33.56 91.41,28.98 92.69,28.98 93.73,27.94 JP12.P1
SCKI  (via drill 0.6)
  Top 0.305: IC1.10 14.62,35.81 14.45,35.65 v14.45,34.9 v14.44,34.89
  Bottom 0.813: v14.44,34.89 12.25,34.89 5.1,38.86 5.1,58.92 10.19,63.07 23.89,63.07 32.17,71.35 32.17,72.3 | 32.17,72.3 32.17,77.77 JP_SIGIN.2 | U$5.13 46.32,73.08 45.55,72.3 32.17,72.3
SCKO1  (via drill 0.6)
  Top 0.305: IC1.11 21.99,35.8 22.23,35.57 v22.23,34.92 | IC2.10 40.68,35.81 39.45,35.81 39.08,35.38 39.08,35.24 v39.08,34.92
  Bottom 0.305: v22.23,34.92 24.73,34.6
  Bottom 0.813: v22.23,34.92 v39.08,34.92
SCKO2  (via drill 0.6)
  Top 0.305: v63.86,34.92 63.87,35.56 64.12,35.81 IC3.10 | IC2.11 47.64,35.81 47.78,35.67 v47.78,35 v47.78,34.99
  Bottom 0.406: 50.64,34.99 50.64,34.98
  Bottom 0.813: v47.78,34.99 50.64,34.98 v63.86,34.92
SCKO3  (via drill 0.6)
  Top 0.305: IC3.11 70.85,35.81 71.91,35.81 72.12,35.59 v72.12,34.6 | v88,34.58 87.99,35.26 87.99,35.27 88.53,35.8 IC4.10
  Bottom 0.813: v72.12,34.6 v88,34.58
SDTI  (via drill 0.6)
  Top 0.305: v14.77,33.34 13.73,33.34 13.34,33.73 13.34,35.64 14.16,36.46 IC1.9
  Top 0.406: 43.76,59.82 U$5.11
  Top 0.813: v21.98,65.93 40.68,65.93 43.76,62.85 43.76,59.82
  Bottom 0.813: v14.77,33.34 11.57,33.34 3.19,38.22 3.19,61.47 9.24,65.93 v21.98,65.93 25.16,69.12 25.8,69.75 27.71,69.75 29.94,71.98 29.94,77.45 JP_SIGIN.1
SDTO1  (via drill 0.6, 0.6 pad 1.02)
  Top 0.305: IC1.12 22.45,36.46 23.5,35.33 23.5,34.14 22.64,33.34 v20.32,33.34 | v40.66,33.34 38.84,33.34 37.8,34 37.8,35.16 39.25,36.46 IC2.9
  Bottom 0.305: 20.39,33.4 v20.32,33.34
  Bottom 0.813: v20.32,33.34 v40.66,33.34
SDTO2  (via drill 0.6)
  Top 0.305: v64.5,33.34 63.49,33.34 62.62,34.15 62.62,35.31 63.96,36.46 IC3.9 | IC2.12 47.95,36.46 49.05,35.35 49.05,34.21 48.17,33.33 46.71,33.33 v46.7,33.34
  Bottom 0.406: 46.5,33.53 v46.7,33.34
  Bottom 0.813: v46.7,33.34 v64.5,33.34
SDTO3  (via drill 0.6)
  Top 0.305: v89.15,32.95 88.1,33 87.05,34.06 87.05,35.28 88.35,36.46 IC4.9 | IC3.12 70.81,36.47 72.2,36.46 73.25,35.54 73.25,34.22 72.67,33.49 v71.48,33.02
  Bottom 0.813: v71.48,33.02 v89.15,32.95
VCC  (via drill 0.6)
  Top 0.406: IC4.20 96.44,41.66 96.45,42.33 | v104.79,48.1 104.79,50.01 LED1.A | v94.38,47.36 94.36,47.35 C9.1
  Top 0.813: 96.45,42.33 96.43,43 96.43,44.15 96.02,44.7 95.74,45.08 94.27,45.08 C9.1
  Bottom 0.406: 104.84,48.04 v104.79,48.1 95.24,48.1 94.5,47.36 v94.38,47.36

### Text on the board
tPlace: +5V | V+ | +5V | GND | +15V | DIN | CIN | PROG | GND | g | r | 3 | b | g | b | r | CO | g | r | b | g | b | 2 | r | DO | g | b | r | g | b | r | r | g | b | r | g | b | 2 | 3 | 4 | 1
tNames: 0 | 1